# Altium schematic sheet LED_Bargraph.SchDoc
size A3
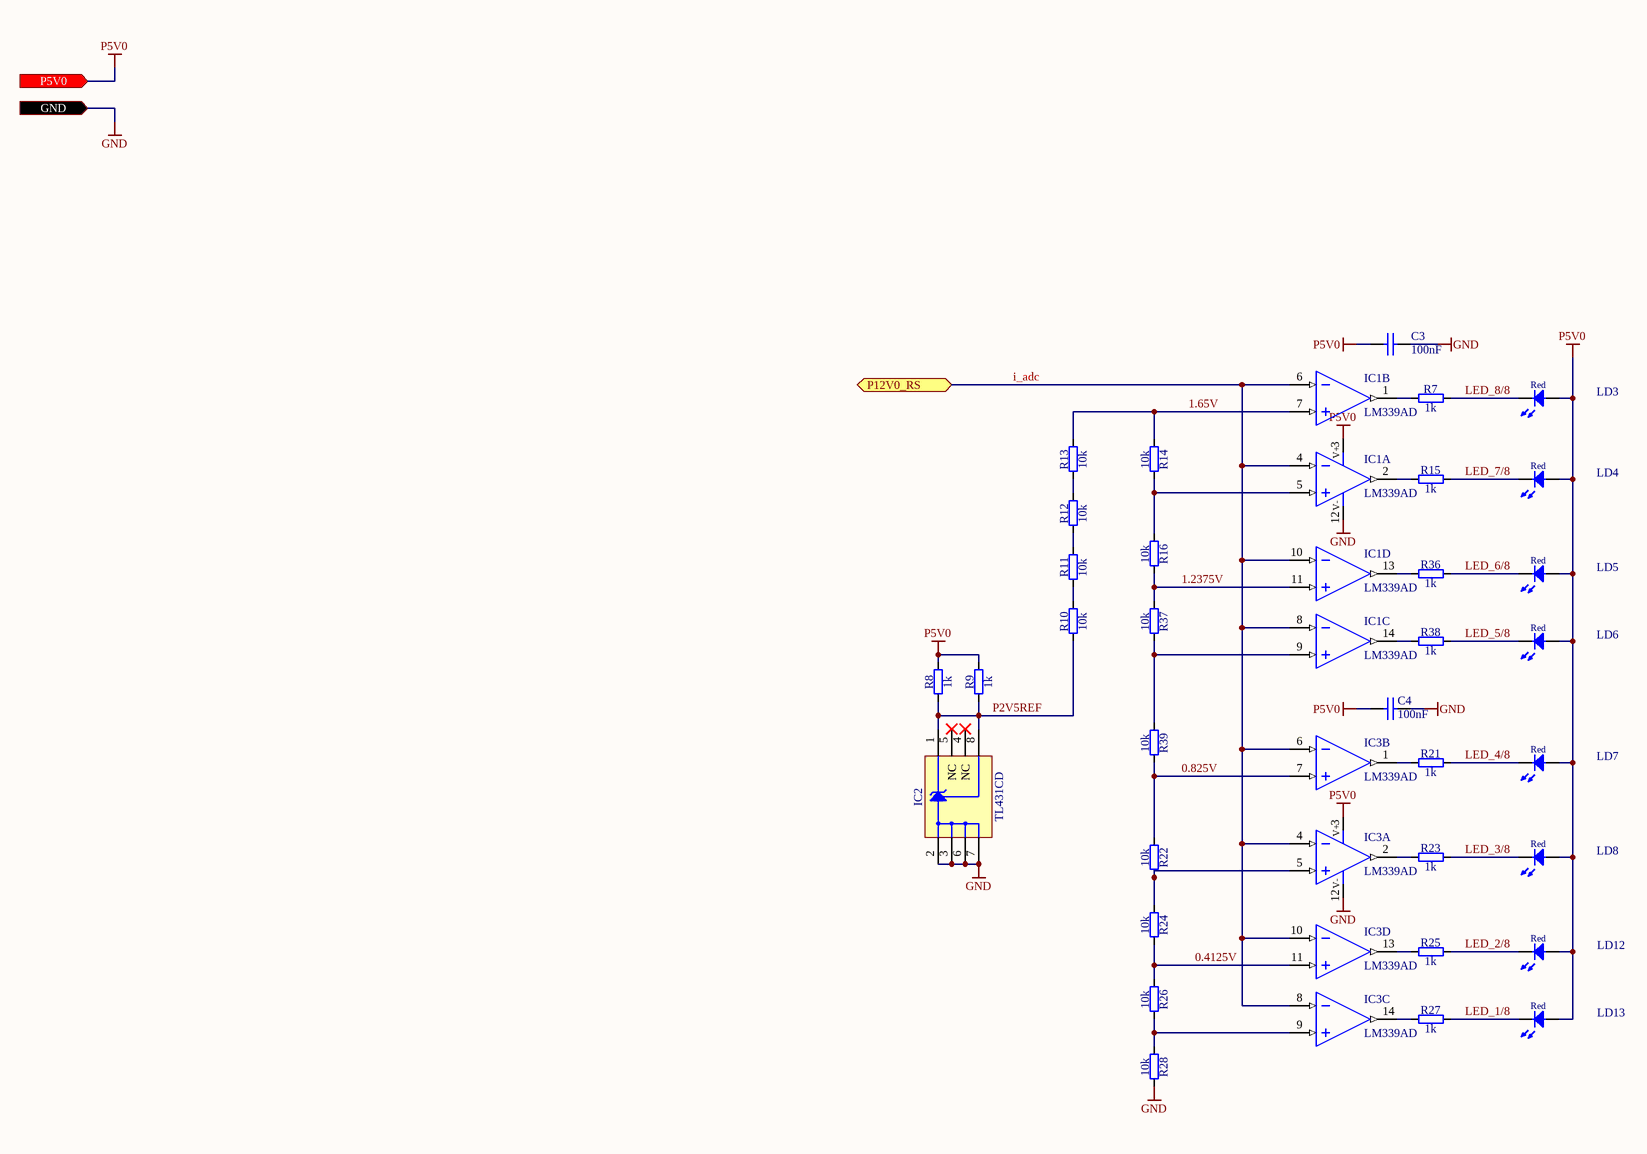
[diagram p0: LED_Bargraph.SchDoc]

## Parts
C3  100nF  [CAPC1608X87N]
C4  100nF  [CAPC1608X87N]
IC1  LM339AD  [SOIC127P600X175-14N]  (parts A,B,C,D of 4)
IC2  TL431CD  [SOIC127P600X175-8N]
IC3  LM339AD  [SOIC127P600X175-14N]  (parts A,B,C,D of 4)
LD3  Red  [LED_AVAGO_HSMC-C120]
LD4  Red  [LED_AVAGO_HSMC-C120]
LD5  Red  [LED_AVAGO_HSMC-C120]
LD6  Red  [LED_AVAGO_HSMC-C120]
LD7  Red  [LED_AVAGO_HSMC-C120]
LD8  Red  [LED_AVAGO_HSMC-C120]
LD12  Red  [LED_AVAGO_HSMC-C120]
LD13  Red  [LED_AVAGO_HSMC-C120]
R7  1k  [RESC1608X55N]
R8  1k  [RESC1608X55N]
R9  1k  [RESC1608X55N]
R10  10k  [RESC1608X55N]
R11  10k  [RESC1608X55N]
R12  10k  [RESC1608X55N]
R13  10k  [RESC1608X55N]
R14  10k  [RESC1608X55N]
R15  1k  [RESC1608X55N]
R16  10k  [RESC1608X55N]
R21  1k  [RESC1608X55N]
R22  10k  [RESC1608X55N]
R23  1k  [RESC1608X55N]
R24  10k  [RESC1608X55N]
R25  1k  [RESC1608X55N]
R26  10k  [RESC1608X55N]
R27  1k  [RESC1608X55N]
R28  10k  [RESC1608X55N]
R36  1k  [RESC1608X55N]
R37  10k  [RESC1608X55N]
R38  1k  [RESC1608X55N]
R39  10k  [RESC1608X55N]

## Ports
GND (in), P5V0 (in), P12V0_RS (bidir)

## Nets
GND: C3.2 C4.2 IC1.12(V-) IC2.2(A) IC2.3(A) IC2.6(A) IC2.7(A) IC3.12(V-) R28.2 ; port GND
P5V0: C3.1 C4.1 IC1.3(V+) IC3.3(V+) LD3.2(A) LD4.2(A) LD5.2(A) LD6.2(A) LD7.2(A) LD8.2(A) LD12.2(A) LD13.2(A) R8.2 R9.2 ; port P5V0
0.825V: IC3.7(IN+) R22.1 R39.2
0.4125V: IC3.11(IN+) R24.2 R26.1
1.65V: IC1.7(IN+) R13.2 R14.1
1.2375V: IC1.11(IN+) R16.2 R37.1
i_adc: IC1.4(IN-) IC1.6(IN-) IC1.8(IN-) IC1.10(IN-) IC3.4(IN-) IC3.6(IN-) IC3.8(IN-) IC3.10(IN-) ; port P12V0_RS
LED_1/8: LD13.1(C) R27.2
LED_2/8: LD12.1(C) R25.2
LED_3/8: LD8.1(C) R23.2
LED_4/8: LD7.1(C) R21.2
LED_5/8: LD6.1(C) R38.2
LED_6/8: LD5.1(C) R36.2
LED_7/8: LD4.1(C) R15.2
LED_8/8: LD3.1(C) R7.2
P2V5REF: IC2.1(C) IC2.8(REF) R8.1 R9.1 R10.1
NetIC1_1: IC1.1(OUT) R7.1
NetIC1_2: IC1.2(OUT) R15.1
NetIC1_5: IC1.5(IN+) R14.2 R16.1
NetIC1_9: IC1.9(IN+) R37.2 R39.1
NetIC1_13: IC1.13(OUT) R36.1
NetIC1_14: IC1.14(OUT) R38.1
NetIC3_1: IC3.1(OUT) R21.1
NetIC3_2: IC3.2(OUT) R23.1
NetIC3_5: IC3.5(IN+) R22.2 R24.1
NetIC3_9: IC3.9(IN+) R26.2 R28.1
NetIC3_13: IC3.13(OUT) R25.1
NetIC3_14: IC3.14(OUT) R27.1
NetR10_2: R10.2 R11.1
NetR11_2: R11.2 R12.1
NetR12_2: R12.2 R13.1

Not connected (* = marked no-connect by the designer): IC2 4(NC)* 5(NC)*

## Library data of the parts
C3 C4 = CC0603_100NF_50V_10%_X5R: Non-polarised capacitor; Part Description: SMD Multilayer Chip Ceramic Capacitor; Manufacturer: GENERIC; Manufacturer1 Part Number: C1608X5R1H104K080; Voltage: 50V; TC: X5R; Tolerance: ±10%; Part Number: CC0603_100NF_50V_10%_X5R; Component Kind: Standard; Component Type: Standard; Pin Count: 2; Value: 100nF; Status: None; Manufacturer Part Number: CC0603_100NF_50V_10%_X5R; Case: 0603; Mounted: Yes; Socket: No; SMD: Yes; Sense: No; Manufacturer1 Example: TDK; Manufacturer1 ComponentHeight: 0.9mm; HelpURL: \\cern.ch\dfs\Applications\Altium\Datasheets\CC0603_X5R_TDK_C.pdf; Author: CERN DEM MR; CreateDate: 08.01.2016; LatestRevisionDate: 08.01.2016
IC1 IC3 = LM339AD: Quad Operational Amplifier; Part Description: Quad Differential Comparator; Manufacturer: TEXAS INSTRUMENTS; PressFit: No; Bonding: No; Part Number: LM339AD; Component Kind: Standard; Component Type: Standard; Device: LM339AD; PackageDescription: SOIC 14, Pitch 1.27mm - Body 4x8.75mm, IPC Medium Density; Manufacturer Part Number: LM339AD; Pin Count: 14; Case: SOIC14; Mounted: Yes; Socket: No; SMD: Yes; Sense: No; ComponentHeight: 1.75mm; Author: CERN DEM JLC; HelpURL: \\cern.ch\dfs\Applications\Altium\Datasheets\LM339AD.pdf; CreateDate: 09.03.2011; LatestRevisionDate: 09.03.2011
IC2 = TL431CD: Precision Programmable Reference; Part Description: Vref (2.5V) To 36V 2% Precision Programmable Reference; Manufacturer: TEXAS INSTRUMENTS; PressFit: No; Bonding: No; Part Number: TL431CD; Component Kind: Standard; Component Type: Standard; Device: TL431CD; PackageDescription: SOIC 8, Pitch 1.27mm, Body 4x5mm, IPC Medium Density; Manufacturer Part Number: TL431CD; Pin Count: 8; Case: SOIC8; Mounted: Yes; Socket: No; SMD: Yes; Sense: No; ComponentHeight: 1.75mm; HelpURL: \\cern.ch\dfs\Applications\Altium\Datasheets\TL431CD.pdf; Author: CERN DEM JLC; CreateDate: 18.01.2011; LatestRevisionDate: 28.02.2011
LD3-LD8 LD12 LD13 = LED_AVAGO_HSMC-C120: LED Red 1C 2A; Part Description: High Performance Right Angle Chip Red LED; Manufacturer: AVAGO TECHNOLOGIES; PressFit: No; Bonding: No; Part Number: LED_AVAGO_HSMC-C120; Component Kind: Standard; Component Type: Standard; Color: Red; PackageDescription: Red Chip LED, 2-Leads, Body 1.7x1.1mm, Side Emitting Package; Manufacturer Part Number: HSMC-C120; Pin Count: 2; Mounted: Yes; Socket: No; SMD: Yes; Sense: No; ComponentHeight: 0.7mm; HelpURL: \\cern.ch\dfs\Applications\Altium\Datasheets\LED_AVAGO_HSMC-C120.pdf; ComponentLink1URL: \\cern.ch\dfs\Applications\Altium\Datasheets\LED_AVAGO_HSMC-C120_DESIGN-GUIDE.pdf; ComponentLink1Description: Design Guide; Author: CERN DEM JMW; CreateDate: 22.07.2009; LatestRevisionDate: 20.06.2012
R7-R9 R15 R21 R23 R25 R27 R36 R38 = R0603_1K_1%_0.1W_100PPM: Resistor - 1%; Part Description: General Purpose Thick Film Chip Resistor; Manufacturer: GENERIC; Manufacturer1 Part Number: NRC06F1001TRF; Power: 0.1W; TC: ±100ppm/°C; PressFit: No; Part Number: R0603_1K_1%_0.1W_100PPM; Component Kind: Standard; Component Type: Standard; Pin Count: 2; Value: 1k; Status: Preferred; Tolerance: ±1%; Manufacturer Part Number: R0603_1K_1%_0.1W_100PPM; Case: 0603; Mounted: Yes; Sense: No; Socket: No; SMD: Yes; Manufacturer1 Example: NIC COMPONENT; Manufacturer1 ComponentHeight: 0.55mm; HelpURL: \\cern.ch\dfs\Applications\Altium\Datasheets\R0603_NIC_NRC.pdf; Author: CERN DEM JLC; CreateDate: 03.12.2007; LatestRevisionDate: 13.03.2008
R10-R14 R16 R22 R24 R26 R28 R37 R39 = R0603_10K_1%_0.1W_100PPM: Resistor - 1%; Part Description: General Purpose Thick Film Chip Resistor; Manufacturer: GENERIC; Manufacturer1 Part Number: NRC06F1002TRF; Power: 0.1W; TC: ±100ppm/°C; PressFit: No; Part Number: R0603_10K_1%_0.1W_100PPM; Component Kind: Standard; Component Type: Standard; Pin Count: 2; Value: 10k; Status: Preferred; Tolerance: ±1%; Manufacturer Part Number: R0603_10K_1%_0.1W_100PPM; Case: 0603; Mounted: Yes; Sense: No; Socket: No; SMD: Yes; Manufacturer1 Example: NIC COMPONENT; Manufacturer1 ComponentHeight: 0.55mm; HelpURL: \\cern.ch\dfs\Applications\Altium\Datasheets\R0603_NIC_NRC.pdf; Author: CERN DEM JLC; CreateDate: 03.12.2007; LatestRevisionDate: 13.03.2008